# Altium project Yukitora.PrjPcb (part 2 of 2)
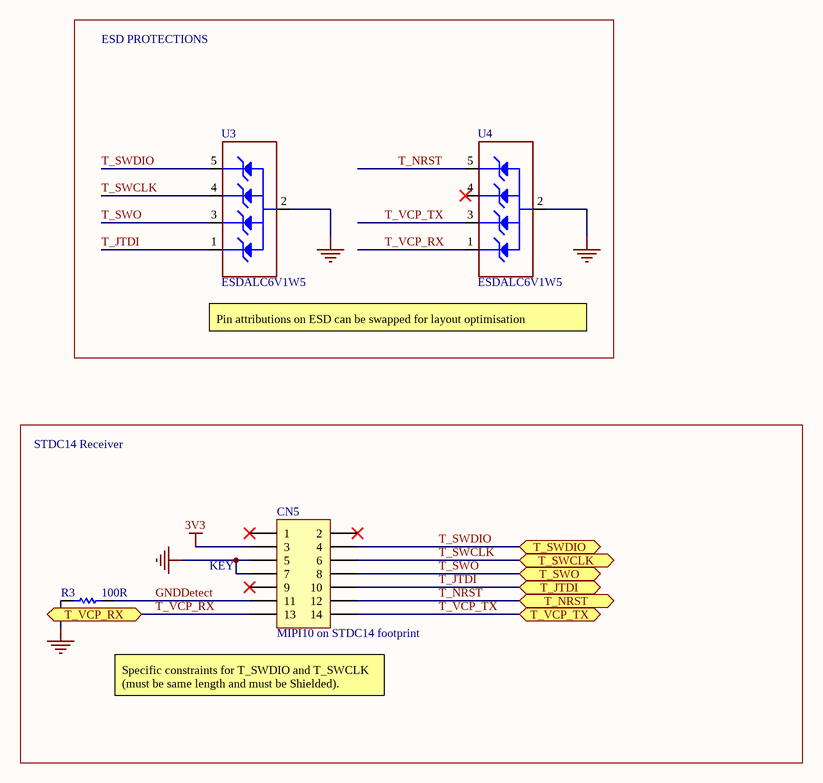
[diagram p7: ST_LINK_V3E.SchDoc]

## Nets that join several sheets
3V3: Connectors (SB1.1), Power_Board (JP2.1 SB11.2 SB12.1 TP1.1), ST_LINK_V3E (CN5.3)
3V3_PER: Connectors (SB2.1), Power_Board (SB12.2)
3V3_VDD: Power_Board (JP2.2), MCU_144_IOs (R7.2), MCU_144_POWER (SB29.1 SB30.1)
AGND: Connectors (C1.1), MCU_144_POWER (6 pins)
GND: Power_Board (10 pins), MCU_144_IOs (8 pins), MCU_144_POWER (26 pins), ST_LINK_V3E (5 pins)
VDD_MCU: Connectors (SB3.1), MCU_144_POWER (26 pins)
VREFP: Connectors (C1.2), MCU_144_POWER (C20.1 C21.2 R12.2 U14.32)
PA15: MCU_144_IOs (U14.110), ST_LINK_V3E (CN5.10 U3.1)
T_VCP_RX: MCU_144_IOs (U14.78 U14.137), ST_LINK_V3E (CN5.13 U4.1)
T_VCP_TX: MCU_144_IOs (U14.77 U14.136), ST_LINK_V3E (CN5.14 U4.3)

## Assembly variants
H743ZI: not fitted C62 C63 C69 C70 C71 C72 CN2 CN11 CN12 R35 R54 R55 R67 SB3 SB4 SB5 SB7 SB9 SB10 SB14 SB15 SB16 SB17 SB18 SB20 SB33 SB34 SB37 SB40 SB41 SB44 SB46 SB47 SB49 SB50 SB55 SB58 SB61 SB62 SB65 SB66 SB69 SB70 SB78 SB79 X3
H7A3ZI: not fitted C62 C63 C69 C70 C71 C72 C73 C74 C75 C76 C77 C78 C79 C80 C81 C82 C83 C85 CN2 CN11 CN12 CN14 HW3 JP6 L1 R35 R40 R41 R42 R43 R44 R45 R46 R47 R48 R49 R50 R51 R52 R53 R54 R55 R57 R58 R59 R67 R75 R76 R77 R78 SB3 SB4 SB5 SB7 SB9 SB10 SB14 SB15 SB16 SB17 SB18 SB20 SB27 SB29 SB30 SB31 SB34 SB35 SB36 SB38 SB40 SB41 SB44 SB46 SB47 SB48 SB54 SB55 SB57 SB58 SB60 SB61 SB62 SB64 SB66 SB69 SB70 SB72 SB74 SB78 SB79 U15 U16 U17 X3 X4
H7B3ZI: not fitted C62 C63 C69 C70 C71 C72 C73 C74 C75 C76 C77 C78 C79 C80 C81 C82 C83 C85 CN2 CN11 CN12 CN14 HW3 JP6 L1 R35 R40 R41 R42 R43 R44 R45 R46 R47 R48 R49 R50 R51 R52 R53 R54 R55 R57 R58 R59 R67 R75 R76 R77 R78 SB3 SB4 SB5 SB7 SB9 SB10 SB14 SB15 SB16 SB17 SB18 SB20 SB27 SB29 SB30 SB31 SB34 SB35 SB36 SB38 SB40 SB41 SB44 SB46 SB47 SB48 SB54 SB55 SB57 SB58 SB60 SB61 SB62 SB64 SB66 SB69 SB70 SB72 SB74 SB78 SB79 U15 U16 U17 X3 X4
H753ZI: not fitted C62 C63 C69 C70 C71 C72 CN2 CN11 CN12 R35 R54 R55 R67 SB3 SB4 SB5 SB7 SB9 SB10 SB14 SB15 SB16 SB17 SB18 SB20 SB33 SB34 SB37 SB40 SB41 SB44 SB46 SB47 SB49 SB50 SB55 SB58 SB61 SB62 SB65 SB66 SB69 SB70 SB78 SB79 X3